# Altium project I2C_ESP32_Module.PrjPCB
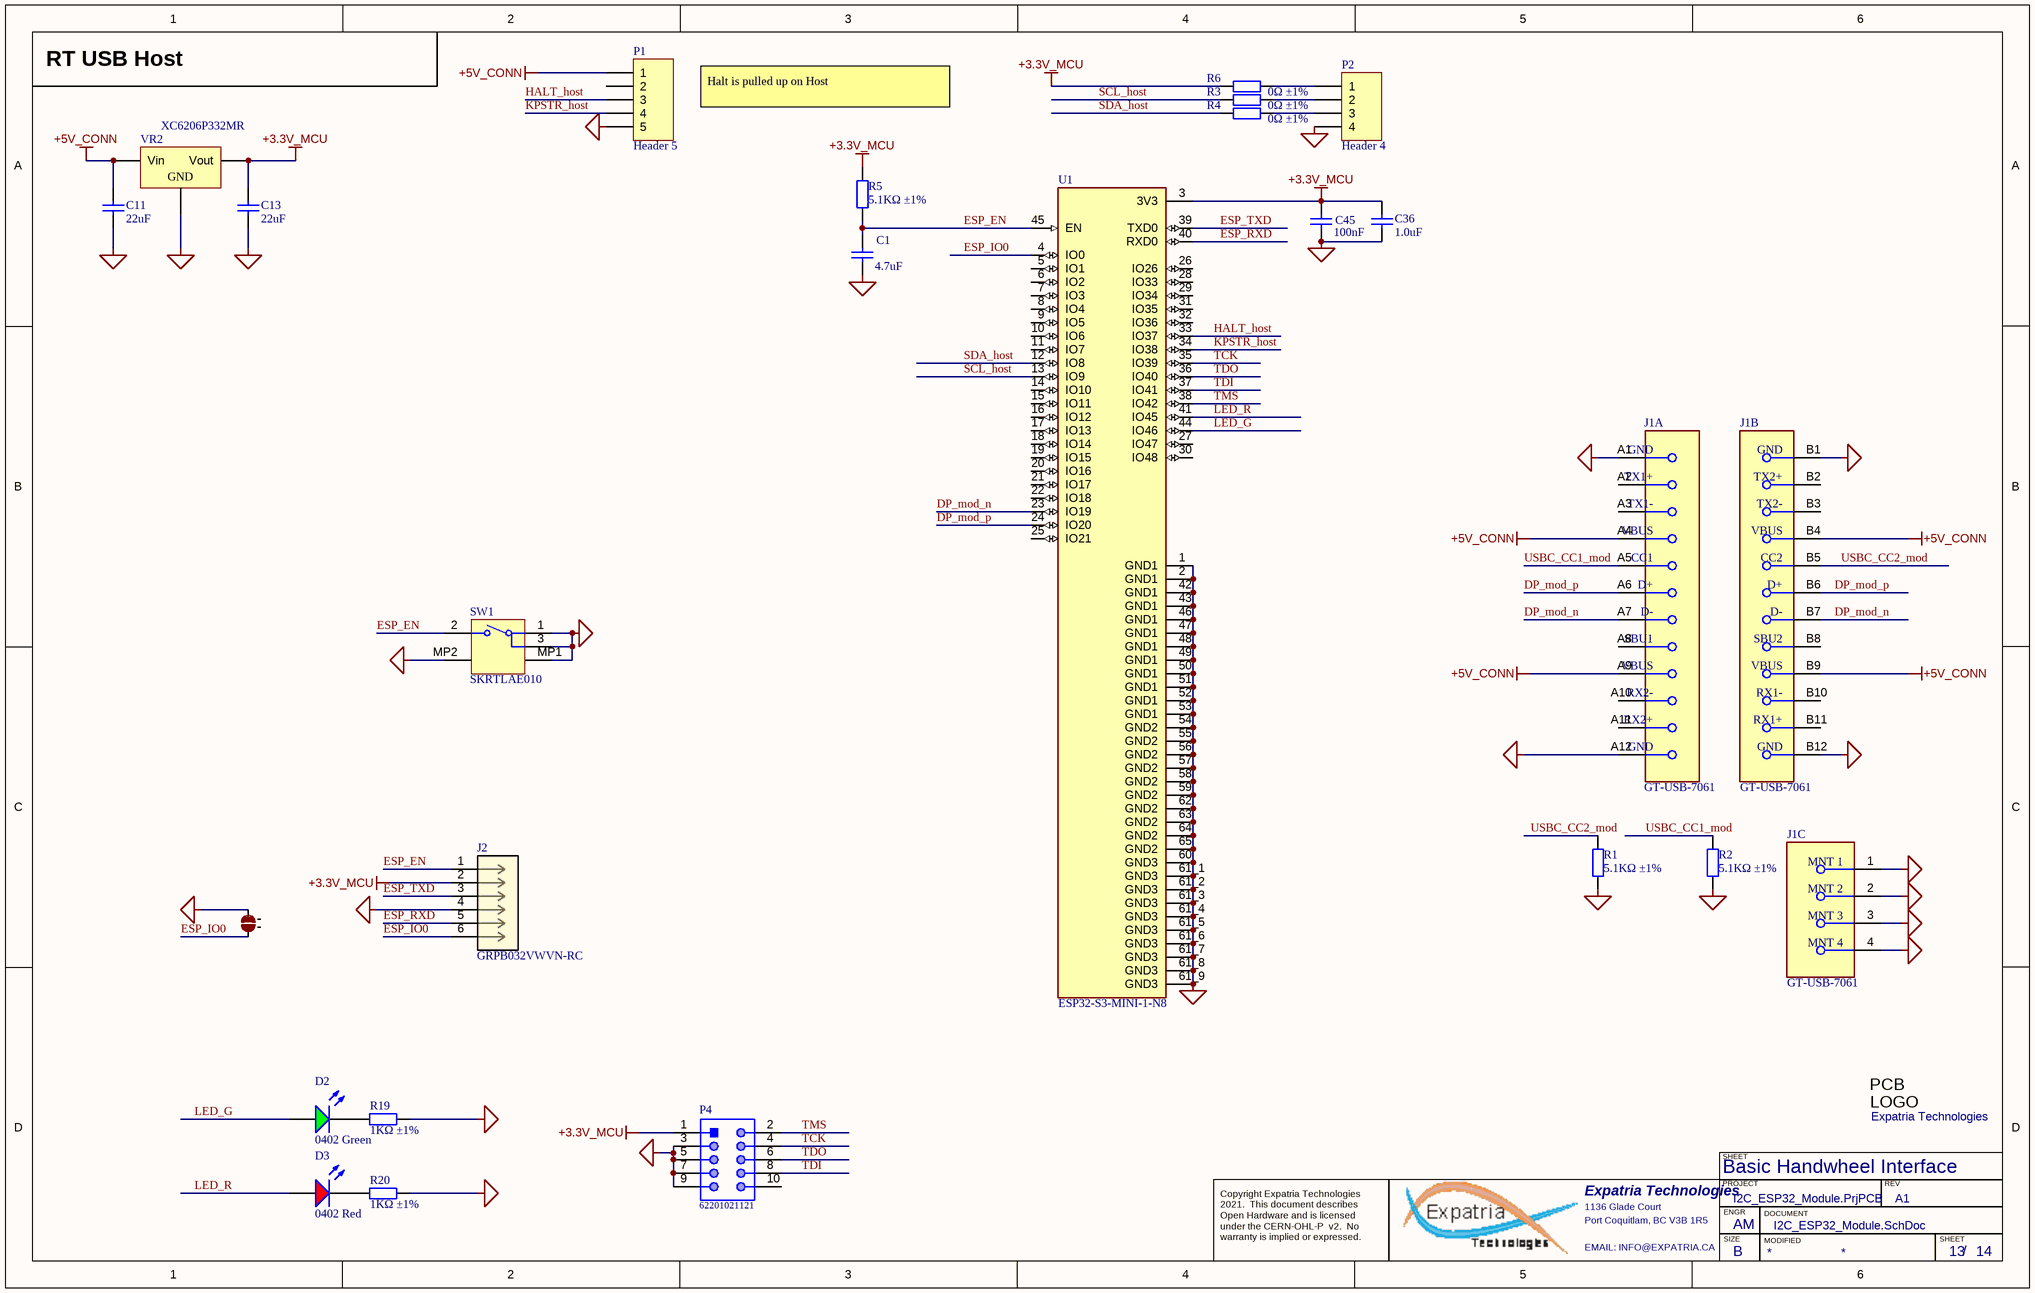
[diagram p0: I2C_ESP32_Module.SchDoc]
PCBPARTNO: Jog3K; PCBREVNO: A1; Title: Jog3K; VarRevNo: A1
1 sheet, 25 parts. Net scope: hierarchical (ports join the sheet entries above them; power ports are global).
Board file: I2C_ESP32_Module.pcbdoc

## Sheet I2C_ESP32_Module.SchDoc: Jog3K
size B; Author: AM; CompanyName: Expatria Technologies; DrawnBy: A.Marles; Engineer: AM; Organization: Expatria Technologies; DocumentNumber: 13; Revision: A1; SheetNumber: 13; SheetTotal: 14; PCB_Rev: A1

### Parts
C1  4.7uF  [0402_C]
C11  22uF  [0603_C]
C13  22uF  [0603_C]
C36  1.0uF  [0402_C]
C45  100nF  [0402_C]
D2  0402 Green  [LED 0402_1005 RED]
D3  0402 Red  [LED 0402_1005 RED]
J1  GT-USB-7061  [USB-C-SMD_GT-USB-7061]  (parts A,B,C of 3)
J2  GRPB032VWVN-RC  [CONN6_GRPB032VWVN-RC_SUL]
J3  2 way net solder junction - Normally Open  [2waySolder_NO]  (value not drawn)  (no BOM)
Logo1  Expatria Technologies  [Expatria-Logo]  (no BOM)
P1  Header 5  [HDR1X5]
P2  Header 4  [HDR1X4]
P4  62201021121  [62201021121]  (no BOM)
R1  5.1KΩ ±1%  [0402_R]
R2  5.1KΩ ±1%  [0402_R]
R3  0Ω ±1%  [0402_R]
R4  0Ω ±1%  [0402_R]
R5  5.1KΩ ±1%  [0402_R]
R6  0Ω ±1%  [0402_R]
R19  1KΩ ±1%  [0402_R]
R20  1KΩ ±1%  [0402_R]
SW1  SKRTLAE010  [ALPS-SKRTLAE010_V]
U1  ESP32-S3-MINI-1-N8  [XCVR_ESP32-S3-MINI-1-N8]
VR2  XC6206P332MR  [SOT-23-3L]

### Nets
+3.3V_MCU: C13.2 C36.2 C45.2 J2.2 P4.1 R5.1 R6.2 U1.3(3V3) VR2.2(Vout)
+5V_CONN: C11.2 J1.A4(VBUS) J1.A9(VBUS) J1.B4(VBUS) J1.B9(VBUS) P1.1 VR2.3(Vin)
GND: C1.1 C11.1 C13.1 C36.1 C45.1 J1.1(MNT_1) J1.2(MNT_2) J1.3(MNT_3) J1.4(MNT_4) J1.A1(GND) J1.A12(GND) J1.B1(GND) J1.B12(GND) J2.4 J3.2 P1.5 P2.4 P4.3 P4.5 P4.7 P4.9 R1.2 R2.2 R19.2 R20.2 SW1.1 SW1.3 SW1.MP1 SW1.MP2 U1.1(GND1) U1.2(GND1) U1.42(GND1) U1.43(GND1) U1.46(GND1) U1.47(GND1) U1.48(GND1) U1.49(GND1) U1.50(GND1) U1.51(GND1) U1.52(GND1) U1.53(GND1) U1.54(GND2) U1.55(GND2) U1.56(GND2) U1.57(GND2) U1.58(GND2) U1.59(GND2) U1.60(GND3) U1.61_1(GND3) U1.61_2(GND3) U1.61_3(GND3) U1.61_4(GND3) U1.61_5(GND3) U1.61_6(GND3) U1.61_7(GND3) U1.61_8(GND3) U1.61_9(GND3) U1.62(GND2) U1.63(GND2) U1.64(GND2) U1.65(GND2) VR2.1(GND)
DP_mod_n: J1.A7(D-) J1.B7(D-) U1.23(IO19)
DP_mod_p: J1.A6(D+) J1.B6(D+) U1.24(IO20)
ESP_EN: C1.2 J2.1 R5.2 SW1.2 U1.45(EN)
ESP_IO0: J2.6 J3.1 U1.4(IO0)
ESP_RXD: J2.5 U1.40(RXD0)
ESP_TXD: J2.3 U1.39(TXD0)
HALT_host: P1.3 U1.33(IO37)
KPSTR_host: P1.4 U1.34(IO38)
LED_G: D2.A U1.44(IO46)
LED_R: D3.A U1.41(IO45)
SCL_host: R3.2 U1.13(IO9)
SDA_host: R4.2 U1.12(IO8)
TCK: P4.4 U1.35(IO39)
TDI: P4.8 U1.37(IO41)
TDO: P4.6 U1.36(IO40)
TMS: P4.2 U1.38(IO42)
USBC_CC1_mod: J1.A5(CC1) R2.1
USBC_CC2_mod: J1.B5(CC2) R1.1
NetD2_K: D2.K R19.1
NetD3_K: D3.K R20.1
NetP2_1: P2.1 R6.1
NetP2_2: P2.2 R3.1
NetP2_3: P2.3 R4.1

Not connected (* = marked no-connect by the designer): J1 A2(TX1+) A3(TX1-) A8(SBU1) A10(RX2-) A11(RX2+) B2(TX2+) B3(TX2-) B8(SBU2) B10(RX1-) B11(RX1+); P1 2; P4 10; U1 5(IO1) 6(IO2) 7(IO3) 8(IO4) 9(IO5) 10(IO6) 11(IO7) 14(IO10) 15(IO11) 16(IO12) 17(IO13) 18(IO14) 19(IO15) 20(IO16) 21(IO17) 22(IO18) 25(IO21) 26(IO26) 27(IO47) 28(IO33) 29(IO34) 30(IO48) 31(IO35) 32(IO36)

### Notes on the sheet
- RT USB Host
- Halt is pulled up on Host
- Basic Handwheel Interface
- SHEET
- Expatria Technologies
- 1136 Glade Court
- Port Coquitlam, BC V3B 1R5
- PROJECT
- SIZE
- ENGR
- MODIFIED
- DOCUMENT
- REV
- Copyright Expatria Technologies 2021.  This document describes Open Hardware and is licensed under the CERN-OHL-P  v2.  No warranty is implied or expressed.
- EMAIL: INFO@EXPATRIA.CA
- B
- /
- (in symbol SBT-Logo) PCB; LOGO

### Library data of the parts
C1 = 0402 4.7uF (475) 20% 10V: Chip capacitor; Manufacturer: Samsung Electro-Mechanics; PartNumber: CL05A475MP5NRNC; Tolerance: 20%; Voltage: 10V; ComponentLink1Description: Supplier link; ComponentLink1URL: http://www.szlcsc.com/product/details_24469.html; Package: 0402; Supplier: LC; SuppliersPartNumber: C23733; Capacitance: 4.7uF
C11 C13 = 0603 22uF (226) 20% 6.3V: Chip capacitors; Manufacturer: Samsung Electro-Mechanics; PartNumber: CL10A226MQ8NRNC; Tolerance: 20%; Voltage: 6.3V; Package: 0603; Supplier: LC; SuppliersPartNumber: C59461; Capacitance: 22uF; ComponentLink1Description: Supplier link; ComponentLink1URL: http://www.szlcsc.com/product/details_60514.html
C36 = 0402 1.0uF (105) 10% 25V: Chip capacitor; Manufacturer: Samsung Electro-Mechanics; PartNumber: CL05A105KA5NQNC; Capacitance: 1uF; Tolerance: 10%; Voltage: 25V; ComponentLink1Description: Supplier link; ComponentLink1URL: http://www.szlcsc.com/product/details_53938.html; Package: 0402; Supplier: LC; SuppliersPartNumber: C52923
C45 = 0402 100nF (104) 10% 16V: Chip capacitors; Manufacturer: Samsung Electro-Mechanics; PartNumber: CL05B104KO5NNNC; Tolerance: 10%; Voltage: 16V; ComponentLink1Description: Supplier link; ComponentLink1URL: http://www.szlcsc.com/product/details_1877.html; Package: 0402; Supplier: LC; SuppliersPartNumber: C1525; Capacitance: 100nF
D2 = 0402 LED Green: LED; Package: 0402; Supplier: LC; SuppliersPartNumber: C130723; Color: Green
D3 = 0402 LED Red: LED; Package: 0402; Supplier: LC; SuppliersPartNumber: C130720; Color: Red
J1 = USBC-GT-USB-7061: CONN RCP USB3.1 TYPEC 24P SMD VERT; Manufacturer: G-Switch; Manufacturer Part Number: GT-USB-7061; SuppliersPartNumber: C2762983
J2 = GRPB032VWVN-RC: Description; Manufacturer_Name: Sullins; Type: Headers, Male Pins; Copyright: Copyright (C) 2025 Ultra Librarian. All rights reserved.; Manufacturer_Part_Number: GRPB032VWVN-RC; RefDes: RefDes
J3 = 2waySolderNO: ComponentLink1URL: http://www.edatools.cz/addons; ComponentLink1Description: Source
Logo1 = SBT-Logo: Manufacturer 1: NONE; Value: Expatria Logo; Manufacturer Part Number 1: NONE
P1 = Header 5: Header, 5-Pin; LatestRevisionDate: 17-Jul-2002; LatestRevisionNote: Re-released for DXP Platform.; Publisher: Altium Limited; SuppliersPartNumber: C124379
P2 = Header 4: Header, 4-Pin; Publisher: Altium Limited; SuppliersPartNumber: C124378
P4 = CMP-1502-00948-1: THT Vertical Pin Header WR-PHD, Pitch 1.27 mm, Dual Row, 10 pins; Manufacturer: Wurth Elektronik; Rated Current: 1A; Pin Number: 10; Working Voltage: 100VAC; Contact Resistance: 20mOhm; Withstanding Voltage: 500VAC; Pitch: 1.27mm; Gender: Male; Mounting Technology: THT; Manufacturer URL: http://www.we-online.de; Package Reference: 62201021121; Row Number: Dual; Datasheet URL: https://katalog.we-online.de/em/datasheet/62201021121.pdf; Publisher: WurthElektronik; Packaging: Box; Operating Temperature: -40to105degC; Orientation: Vertical; Part Number: 62201021121
R1 R2 R5 = 0402 5.1K (5101) 1%: Chip resistor; Manufacturer: Uniroyal Elec; PartNumber: 0402WGF5101TCE; Power: 1/16W; Resistance: 51.1KΩ; ComponentLink1Description: Supplier link; ComponentLink1URL: http://www.szlcsc.com/product/details_26648.html; Package: 0402; Supplier: LC; SuppliersPartNumber: C25905; Tolerance: 1%
R3 R4 R6 = 0402 0R (0R0) 1%: Chip resistor; Manufacturer: Uniroyal Elec; PartNumber: 0402WGF0000TCE; Power: 1/16W; ComponentLink1Description: Supplier link; ComponentLink1URL: http://www.szlcsc.com/product/details_17853.html; Package: 0402; Supplier: LC; SuppliersPartNumber: C17168; Resistance: 0Ω; Tolerance: 1%
R19 R20 = 0402 1K (1001) 1%: Chip resistor; Manufacturer: Uniroyal Elec; PartNumber: 0402WGF1001TCE; Power: 1/16W; ComponentLink1Description: Supplier link; ComponentLink1URL: http://www.szlcsc.com/product/details_12256.html; Package: 0402; Supplier: LC; SuppliersPartNumber: C11702; Resistance: 1KΩ; Tolerance: 1%
SW1 = CMP-2000-07073-2: Side Push Type, 250 V, -40 to 90 degC, 3-Pin SMD, RoHS, Tape and Reel; Manufacturer: ALPS; Operating Force: 1.6N; Folder: Unified Components\Components\New Releases\New\; Maximum Current Rating: 0.05@12VDCA; RevisionId: 1; Pole Throw Configuration: SPST; Switch Configuration: N.O.; AccessRights: 2147483647; Maximum DC Voltage Rating: 12V; ContentType: Unified Component; Rad Hard: No; Mounting: SurfaceMount; Datasheet URL: http://www.alps.com/prod/info/E/PDF/Tact/SurfaceMount/SKRT/SKRT.PDF; Manufacturer URL: http://www.alps.com/e/; ReleaseDate: 22/09/2017 06:13:25 AM; ItemHRID: CMP-2000-07073; ContentTypeGUID: CB3C11C4-E317-11DF-B822-12313F0024A2; LifeCycle: Released; ItemGUID: EAC55BEC-37DC-4BDB-8BA7-D75E6D5C3D75; Packaging: Tape&Reel; Package Reference: SKRTLAE010; FolderGUID: B7F4506A-9127-42E7-A087-46FE7B18D116; Datasheet Version: 06/2015; Mounting Technology: SurfaceMount; LifeCycleStateGUID: 61E382EE-6656-4F12-9E24-BE9327104A25; Package Description: 3-Pin Surface Mount Device, Body 4.5 x 3.55 mm, Pitch 1.225 mm; SuppliersPartNumber: C110293; Manufacturer 1: ALPS
U1 = ESP32-S3-MINI-1U-N8: Bluetooth, WiFi 802.11b/g/n, Bluetooth v5.0 Transceiver Module 2.4GHz Antenna; MF: Espressif Systems; Package: VFQFN-56 Espressif Systems; Value: *; MP: ESP32-S3-MINI-1-N8
VR2 = SOT-23 XC6206P332MR: 200mA 680mV@(100mA) Fixed 3.3V~3.3V Positive 1 6V SOT-23-3L Linear Voltage Regulators (LDO) ROHS; ComponentLink1Description: 供应商链接; ComponentLink1URL: http://www.szlcsc.com/product/details_5896.html; Package: SOT-23; Supplier: LC; SuppliersPartNumber: C5446

## Assembly variants
FULL_ASSEMBLY: not fitted J1 P1 Q2